# Altium project XT_NANO_DOCK.PrjPcb
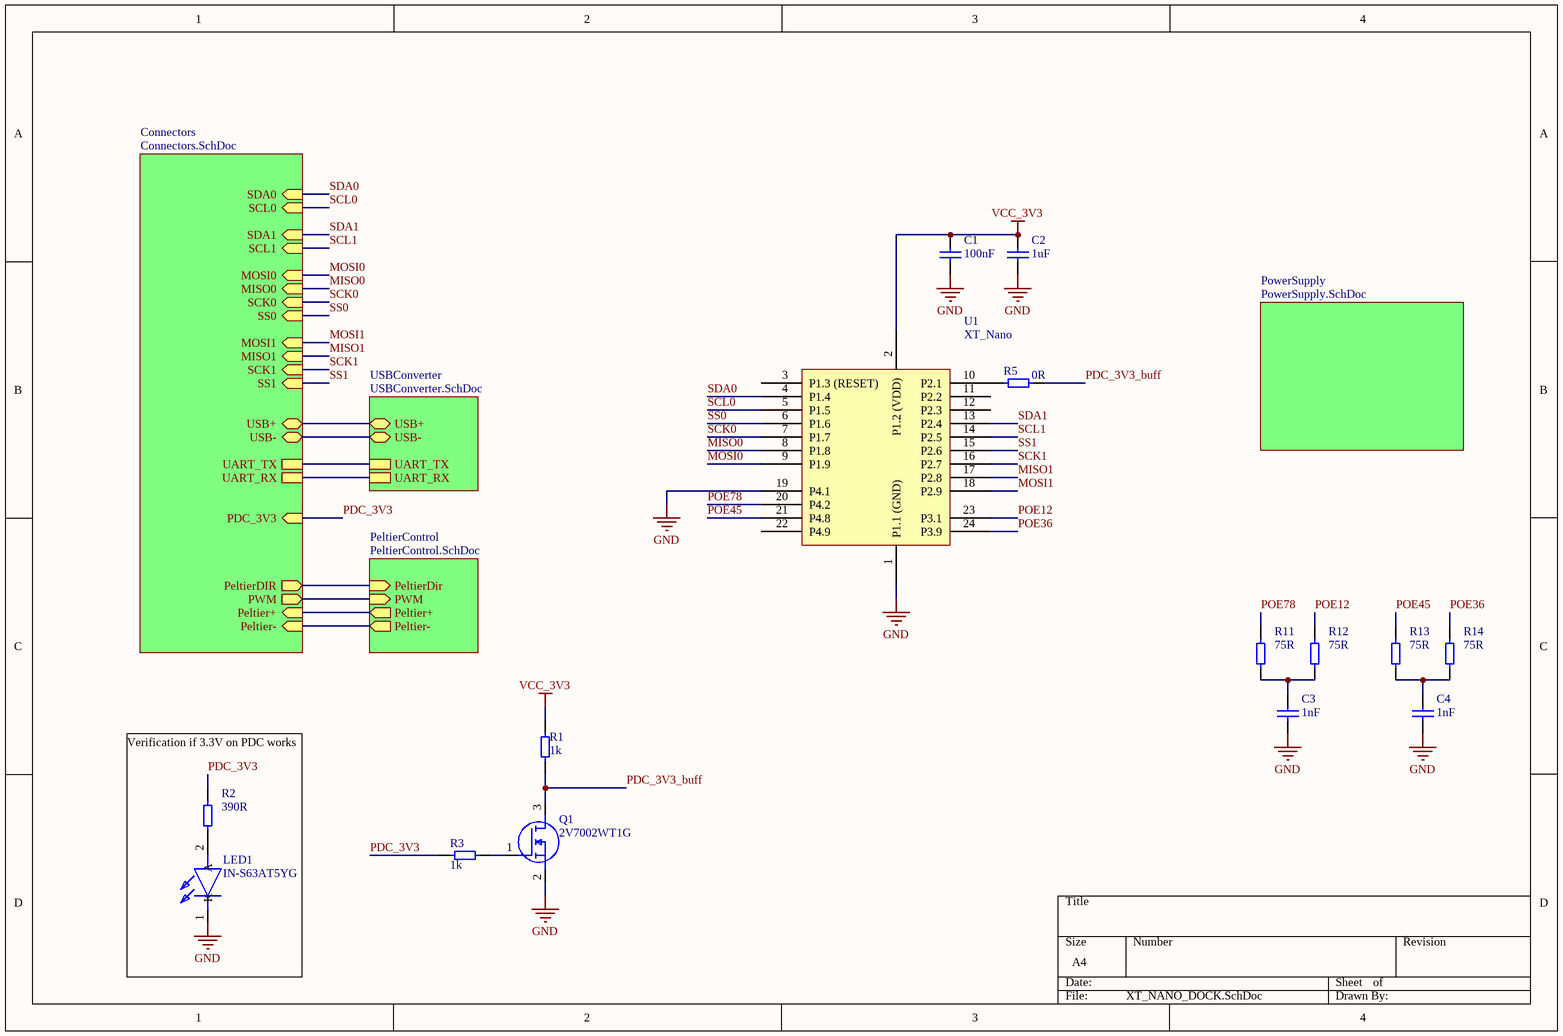
[diagram p0: XT_NANO_DOCK.SchDoc]
6 sheets, 111 parts. Net scope: hierarchical (ports join the sheet entries above them; power ports are global).
Board file: XT_NANO_DOCK.PcbDoc
Sheets:
  XT_NANO_DOCK.SchDoc
    PowerSupply = PowerSupply.SchDoc
    PeltierControl = PeltierControl.SchDoc
    Connectors = Connectors.SchDoc
      Protection = Protection.SchDoc
    USBConverter = USBConverter.SchDoc

## Sheet XT_NANO_DOCK.SchDoc
size A4

### Parts
C1  100nF  [0603-Capacitor]
C2  1uF  [0603-Capacitor]
C3  1nF  [0603-Capacitor]
C4  1nF  [0603-Capacitor]
LED1  IN-S63AT5YG  [LEDM168X39N]
Q1  2V7002WT1G  [SOT65P220X100-3N]
R1  1k  [0603-Resistor]
R2  390R  [0603-Resistor]
R3  1k  [0603-Resistor]
R5  0R  [0603-Resistor]
R11  75R  [0603-Resistor]
R12  75R  [0603-Resistor]
R13  75R  [0603-Resistor]
R14  75R  [0603-Resistor]
U1  XT_Nano  [XT-PICO]

### Sub-sheets
Connectors = Connectors.SchDoc: SDA0 (in), SCL0 (in), SDA1 (in), SCL1 (in), MISO0 (in), SCK0 (in), SS0 (in), MOSI0 (in), MISO1 (in), SCK1 (in), SS1 (in), MOSI1 (in), USB+ (bidir), USB- (bidir), PDC_3V3 (in), PeltierDIR (out), PWM (out), UART_TX, UART_RX, Peltier+ (in), Peltier- (in)
PeltierControl = PeltierControl.SchDoc: PWM (in), PeltierDir (in), Peltier+ (out), Peltier- (out)
PowerSupply = PowerSupply.SchDoc: no entries
USBConverter = USBConverter.SchDoc: USB- (bidir), USB+ (bidir), UART_TX, UART_RX

### Nets
GND: C1.2 C2.2 C3.2 C4.2 LED1.1(K) Q1.2(S) U1.1(P1.1_(GND)) U1.19(P4.1)
VCC_3V3: C1.1 C2.1 R1.1 U1.2(P1.2_(VDD))
MISO0: U1.8(P1.8) ; sheet Connectors/MISO0
MISO1: U1.17(P2.8) ; sheet Connectors/MISO1
MOSI0: U1.9(P1.9) ; sheet Connectors/MOSI0
MOSI1: U1.18(P2.9) ; sheet Connectors/MOSI1
PDC_3V3: R2.2 R3.2 ; sheet Connectors/PDC_3V3
PDC_3V3_buff: Q1.3(D) R1.2 R5.1
POE12: R12.2 U1.23(P3.1)
POE36: R14.2 U1.24(P3.9)
POE45: R13.2 U1.21(P4.8)
POE78: R11.2 U1.20(P4.2)
SCK0: U1.7(P1.7) ; sheet Connectors/SCK0
SCK1: U1.16(P2.7) ; sheet Connectors/SCK1
SCL0: U1.5(P1.5) ; sheet Connectors/SCL0
SCL1: U1.14(P2.5) ; sheet Connectors/SCL1
SDA0: U1.4(P1.4) ; sheet Connectors/SDA0
SDA1: U1.13(P2.4) ; sheet Connectors/SDA1
SS0: U1.6(P1.6) ; sheet Connectors/SS0
SS1: U1.15(P2.6) ; sheet Connectors/SS1
USB_prot_N: sheet Connectors/USB-, sheet USBConverter/USB-
USB_prot_P: sheet Connectors/USB+, sheet USBConverter/USB+
NetC3_1: C3.1 R11.1 R12.1
NetC4_1: C4.1 R13.1 R14.1
NetIC1_1: sheet PeltierControl/PWM, sheet Connectors/PWM
NetIC2_1: sheet PeltierControl/PeltierDir, sheet Connectors/PeltierDIR
NetJ1_2: sheet Connectors/UART_TX, sheet USBConverter/UART_TX
NetJ1_10: sheet Connectors/UART_RX, sheet USBConverter/UART_RX
NetJ6_1: sheet PeltierControl/Peltier-, sheet Connectors/Peltier-
NetJ6_2: sheet PeltierControl/Peltier+, sheet Connectors/Peltier+
NetLED1_2: LED1.2(A) R2.1
NetQ1_1: Q1.1(G) R3.1
NetR5_2: R5.2 U1.10(P2.1)

Not connected (* = marked no-connect by the designer): U1 3(P1.3_(RESET)) 11(P2.2) 12(P2.3) 22(P4.9)

### Notes on the sheet
- Verification if 3.3V on PDC works

### Library data of the parts
C1-C4 = C0603: Capacitor; Part Number: C0603; Pin Count: 2; Manufacturer: *; Package: 0603; ManufacturerNr: *; Voltage Rating: *; Dielectric: *
  C1: Value: 100nF
  C2: Value: 1uF
  C3 C4: Value: 1nF
LED1 = IN-S63AT5G: LED; Manufacturer_Name: Inolux; Datasheet Link: http://www.inolux-corp.com/datasheet/SMDLED/Mono%20Color%20Top%20View/IN-S63AT%20Series_V1.1.pdf; Height: 0.39mm; Manufacturer_Part_Number: IN-S63AT5YG; Mouser Part Number: 743-IN-S63AT5G; Mouser Price/Stock: https://www.mouser.com/Search/Refine.aspx?Keyword=743-IN-S63AT5G
Q1 = 2V7002WT1G: MOSFET (N-Channel); Manufacturer_Name: ON Semiconductor; Datasheet Link: http://www.onsemi.com/pub/Collateral/2N7002W-D.PDF; Height: 1mm; Manufacturer_Part_Number: 2V7002WT1G; Mouser Part Number: 863-2V7002WT1G; Mouser Price/Stock: https://www.mouser.com/Search/Refine.aspx?Keyword=863-2V7002WT1G; RS Part Number: 7905246P; RS Price/Stock: http://uk.rs-online.com/web/p/products/7905246P
R1 R3 R5 R11-R14 = R0603: Resistor; Part Number: R0603; Pin Count: 2; Manufacturer: *; Package: 0603; ManufacturerNr: *
  R1 R3: Value: 1k
  R5: Value: 0R
  R11-R14: Value: 75R
R2 = R0603: Resistor; Part Number: R0603; Value: 680R; Pin Count: 2; Manufacturer: *; Package: 0603; ManufacturerNr: *
U1 = XT_Nano: XT nano module by ak-nord; Manufacturer Nr: XT-NANO-SXL; Manufacturer: Ak-nord

## Sheet PowerSupply.SchDoc
size A4
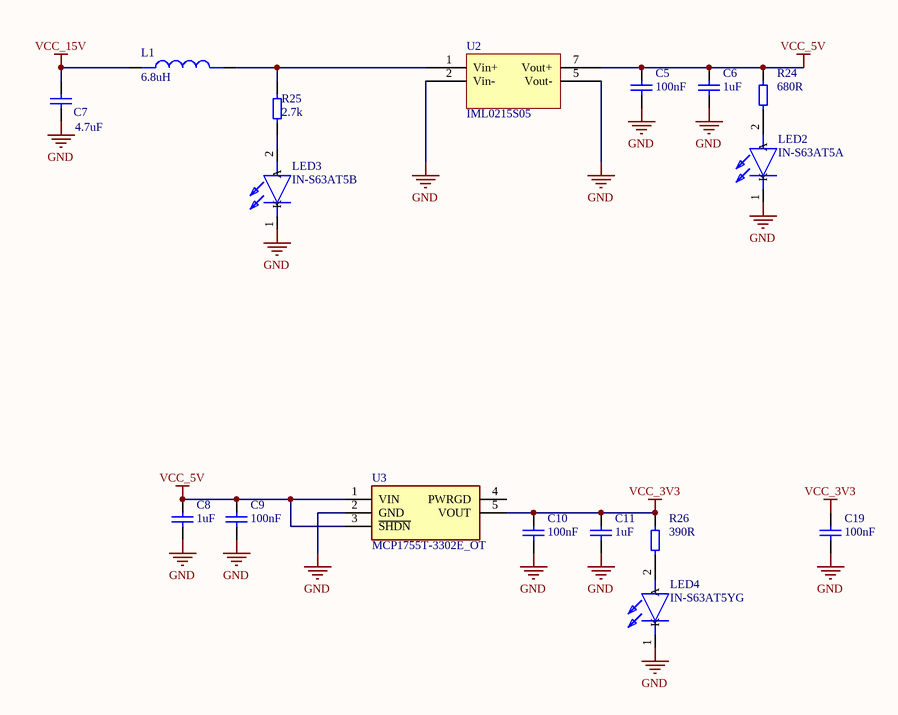
[diagram p1: PowerSupply.SchDoc]

### Parts
C5  100nF  [0603-Capacitor]
C6  1uF  [0603-Capacitor]
C7  4.7uF  [1206-Capacitor]
C8  1uF  [0603-Capacitor]
C9  100nF  [0603-Capacitor]
C10  100nF  [0603-Capacitor]
C11  1uF  [0603-Capacitor]
C19  100nF  [0603-Capacitor]
L1  6.8uH  [NRH2410T6R8MN]
LED2  IN-S63AT5A  [LEDM168X39N]
LED3  IN-S63AT5B  [LEDM168X39N]
LED4  IN-S63AT5YG  [LEDM168X39N]
R24  680R  [0603-Resistor]
R25  2.7k  [0805-Resistor]
R26  390R  [0603-Resistor]
U2  IML0215S05  [IML02S]
U3  MCP1755T-3302E_OT  [SOT95P270X145-5N]

### Nets
GND: C5.2 C6.2 C7.2 C8.2 C9.2 C10.2 C11.2 C19.2 LED2.1(K) LED3.1(K) LED4.1(K) U2.2(Vin-) U2.5(Vout-) U3.2(GND)
VCC_3V3: C10.1 C11.1 C19.1 R26.2 U3.5(VOUT)
VCC_5V: C5.1 C6.1 C8.1 C9.1 R24.2 U2.7(Vout+) U3.1(VIN) U3.3(~{SHDN})
VCC_15V: C7.1 L1.1(RF-IN)
NetL1_2: L1.2(RF-OUT) R25.2 U2.1(Vin+)
NetLED2_2: LED2.2(A) R24.1
NetLED3_2: LED3.2(A) R25.1
NetLED4_2: LED4.2(A) R26.1

Not connected (* = marked no-connect by the designer): U3 4(PWRGD)

### Library data of the parts
C5 C6 C8-C11 C19 = C0603: Capacitor; Part Number: C0603; Pin Count: 2; Manufacturer: *; Package: 0603; ManufacturerNr: *; Voltage Rating: *; Dielectric: *
  C5 C9 C10 C19: Value: 100nF
  C6 C8 C11: Value: 1uF
C7 = C1206: Capacitor; Part Number: C1206; Pin Count: 2; Manufacturer: *; Package: 1206; ManufacturerNr: *; Value: 4.7uF; Voltage Rating: *; Dielectric: *
L1 = LQG18HN22NJ00D: Chip Inductor; Manufacturer: Taiyo Yuden; Value: 6.8uH; Part Number: NRH2410T6R8MN; Pin Count: 2; ManufacturerNr: NRH2410T6R8MN
LED2-LED4 = IN-S63AT5G: LED; Manufacturer_Name: Inolux; Datasheet Link: http://www.inolux-corp.com/datasheet/SMDLED/Mono%20Color%20Top%20View/IN-S63AT%20Series_V1.1.pdf; Height: 0.39mm; Mouser Part Number: 743-IN-S63AT5G; Mouser Price/Stock: https://www.mouser.com/Search/Refine.aspx?Keyword=743-IN-S63AT5G
  LED2: Manufacturer_Part_Number: IN-S63AT5A
  LED3: Manufacturer_Part_Number: IN-S63AT5B
  LED4: Manufacturer_Part_Number: IN-S63AT5YG
R24 = R0603: Resistor; Part Number: R0603; Pin Count: 2; Manufacturer: *; Package: 0603; ManufacturerNr: *; Value: 680R
R25 = R0805: Resistor; Part Number: R0805; Pin Count: 2; Manufacturer: *; Package: 0805; ManufacturerNr: *; Value: 2.7k
R26 = R0603: as R2 on sheet XT_NANO_DOCK; Pin Count: 2; Manufacturer: *; Package: 0603; ManufacturerNr: *
U2 = IML0215S05: XP power converter 15V->5V, 400mA; Manufacturer: XP Power; Manufacturer Nr: IML0215S05
U3 = MCP1755T-3302E_OT: Undefined or Miscellaneous; Manufacturer_Name: Microchip; Manufacturer_Part_Number: MCP1755T-3302E/OT; Datasheet Link: https://componentsearchengine.com/Datasheets/1/MCP1755T-3302E_OT.pdf; Height: 1.45mm

## Sheet PeltierControl.SchDoc
size A4
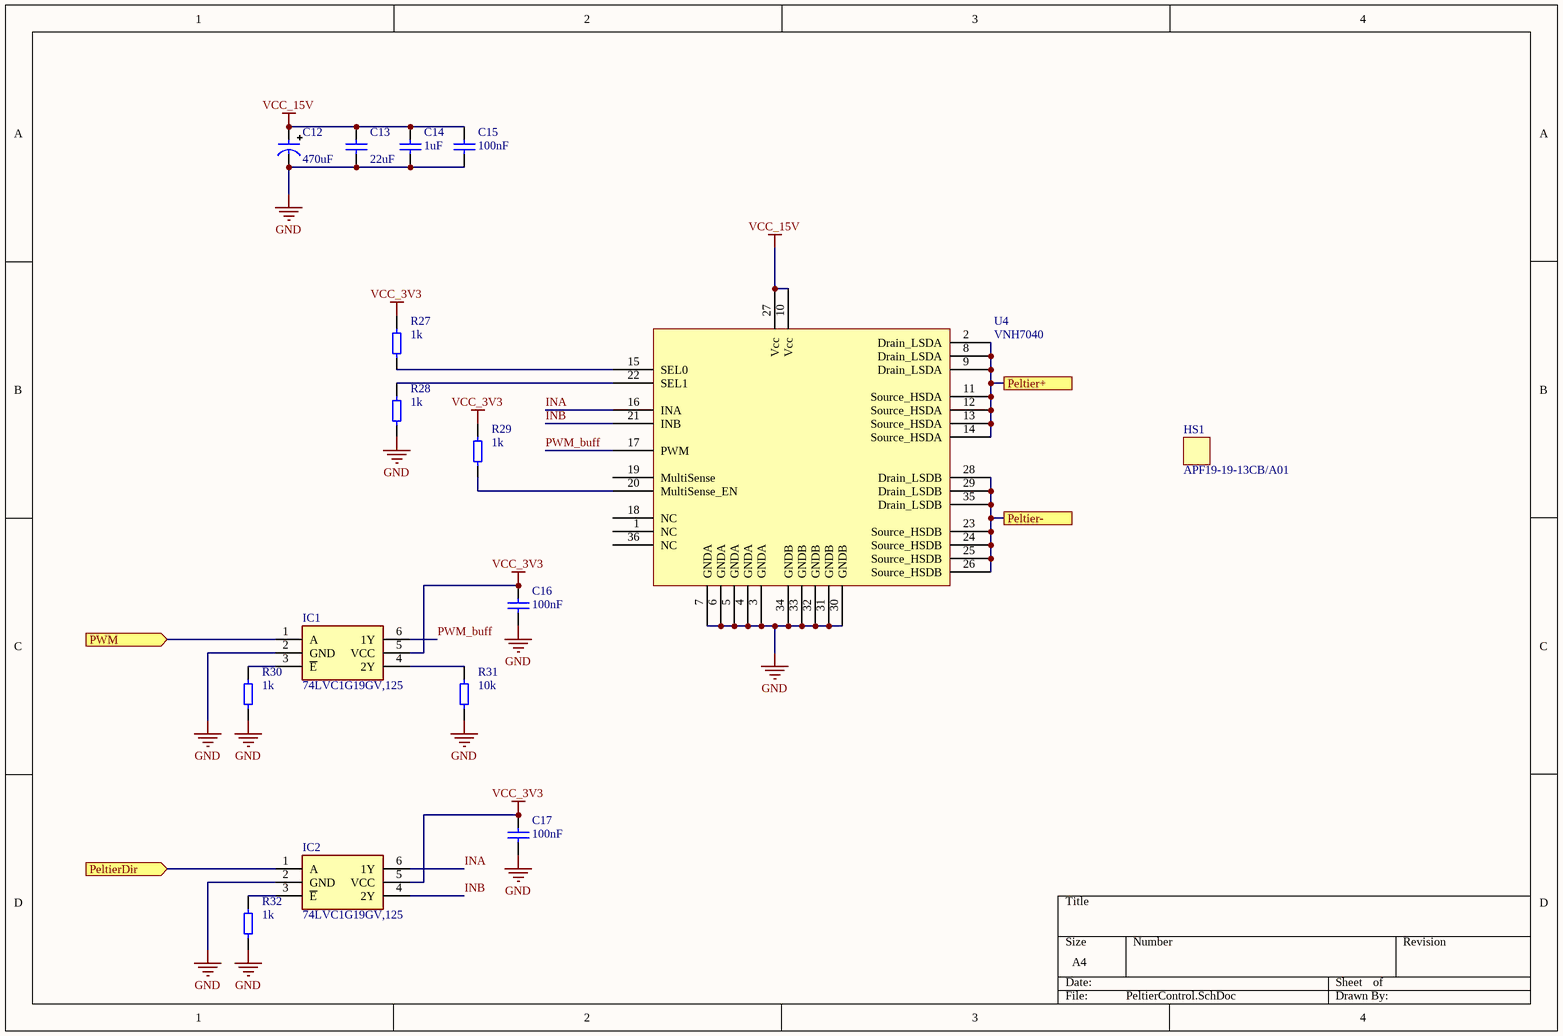
[diagram p2: PeltierControl.SchDoc]

### Parts
C12  470uF  [EEV-FK1H471M]
C13  22uF  [0805-Capacitor]
C14  1uF  [0603-Capacitor]
C15  100nF  [0603-Capacitor]
C16  100nF  [0603-Capacitor]
C17  100nF  [0603-Capacitor]
HS1  APF19-19-13CB/A01  [APF19-19-13CB/A01]
IC1  74LVC1G19GV,125  [SOT95P275X110-6N]
IC2  74LVC1G19GV,125  [SOT95P275X110-6N]
R27  1k  [0603-Resistor]
R28  1k  [0603-Resistor]
R29  1k  [0603-Resistor]
R30  1k  [0603-Resistor]
R31  10k  [0603-Resistor]
R32  1k  [0603-Resistor]
U4  VNH7040  [PowerSSO-36]

### Ports
Peltier+, Peltier-, PeltierDir (in), PWM (in)

### Nets
GND: C12.2 C13.2 C14.2 C15.2 C16.2 C17.2 IC1.2(GND) IC2.2(GND) R28.1 R30.1 R31.1 R32.1 U4.3(GNDA) U4.4(GNDA) U4.5(GNDA) U4.6(GNDA) U4.7(GNDA) U4.30(GNDB) U4.31(GNDB) U4.32(GNDB) U4.33(GNDB) U4.34(GNDB)
VCC_3V3: C16.1 C17.1 IC1.5(VCC) IC2.5(VCC) R27.2 R29.2
VCC_15V: C12.1 C13.1 C14.1 C15.1 U4.10(Vcc) U4.27(Vcc)
INA: IC2.6(1Y) U4.16(INA)
INB: IC2.4(2Y) U4.21(INB)
PWM_buff: IC1.6(1Y) U4.17(PWM)
NetIC1_1: IC1.1(A) ; port PWM
NetIC1_3: IC1.3(~{E}) R30.2
NetIC1_4: IC1.4(2Y) R31.2
NetIC2_1: IC2.1(A) ; port PeltierDir
NetIC2_3: IC2.3(~{E}) R32.2
NetJ6_1: U4.23(Source_HSDB) U4.24(Source_HSDB) U4.25(Source_HSDB) U4.26(Source_HSDB) U4.28(Drain_LSDB) U4.29(Drain_LSDB) U4.35(Drain_LSDB) ; port Peltier-
NetJ6_2: U4.2(Drain_LSDA) U4.8(Drain_LSDA) U4.9(Drain_LSDA) U4.11(Source_HSDA) U4.12(Source_HSDA) U4.13(Source_HSDA) U4.14(Source_HSDA) ; port Peltier+
NetR27_1: R27.1 U4.15(SEL0)
NetR28_2: R28.2 U4.22(SEL1)
NetR29_1: R29.1 U4.20(MultiSense_EN)

Not connected (* = marked no-connect by the designer): U4 1(NC) 18(NC) 19(MultiSense) 36(NC)

### Library data of the parts
C12 = Panasonic_FK_PCR_6.3_Capacitor: Aluminum Electrolytic Capacitors; Voltage Rating: 50V; Tolerance: 20%; HelpURL: http://www.farnell.com/datasheets/2002520.pdf?_ga=2.2422448.16562209.1508850292-516227586.1495631175; Supplier 1: Farnell; Package: PCR-6.3-7.7; Manufacturer: Panasonic; Supplier Part Number 1: *; ManufacturerNr: EEV-FK1H471M; Pin Count: 2; Value: 470uF; Dielectric: Aluminum Electrolytic; Series: FK; Part Number: Panasonic_FK_PCR_6.3_Capacitor
C13 = C0805: Capacitor; Part Number: C0805; Pin Count: 2; Manufacturer: *; Package: 0805; ManufacturerNr: *; Value: 22uF; Voltage Rating: *; Dielectric: *
C14-C17 = C0603: Capacitor; Part Number: C0603; Pin Count: 2; Manufacturer: *; Package: 0603; ManufacturerNr: *; Voltage Rating: *; Dielectric: *
  C14: Value: 1uF
  C15-C17: Value: 100nF
HS1 = heatsink: Manufacturer: CTS Electronic Components; Manufacturer Nr: APF19-19-13CB/A01
IC1 IC2 = 74LVC1G19GV,125: Integrated Circuit; Manufacturer_Name: Nexperia; Datasheet Link: https://assets.nexperia.com/documents/data-sheet/74LVC1G19.pdf; Height: 1.1mm; Manufacturer_Part_Number: 74LVC1G19GV,125
R27-R32 = R0603: Resistor; Part Number: R0603; Pin Count: 2; Manufacturer: *; Package: 0603; ManufacturerNr: *
  R27-R30 R32: Value: 1k
  R31: Value: 10k
U4 = VNH7040: Engine driver/ H bridge; Manufacturer: STMicroelectronics; Manufacturer Nr: VNH7040AYTR

## Sheet Connectors.SchDoc
size A4
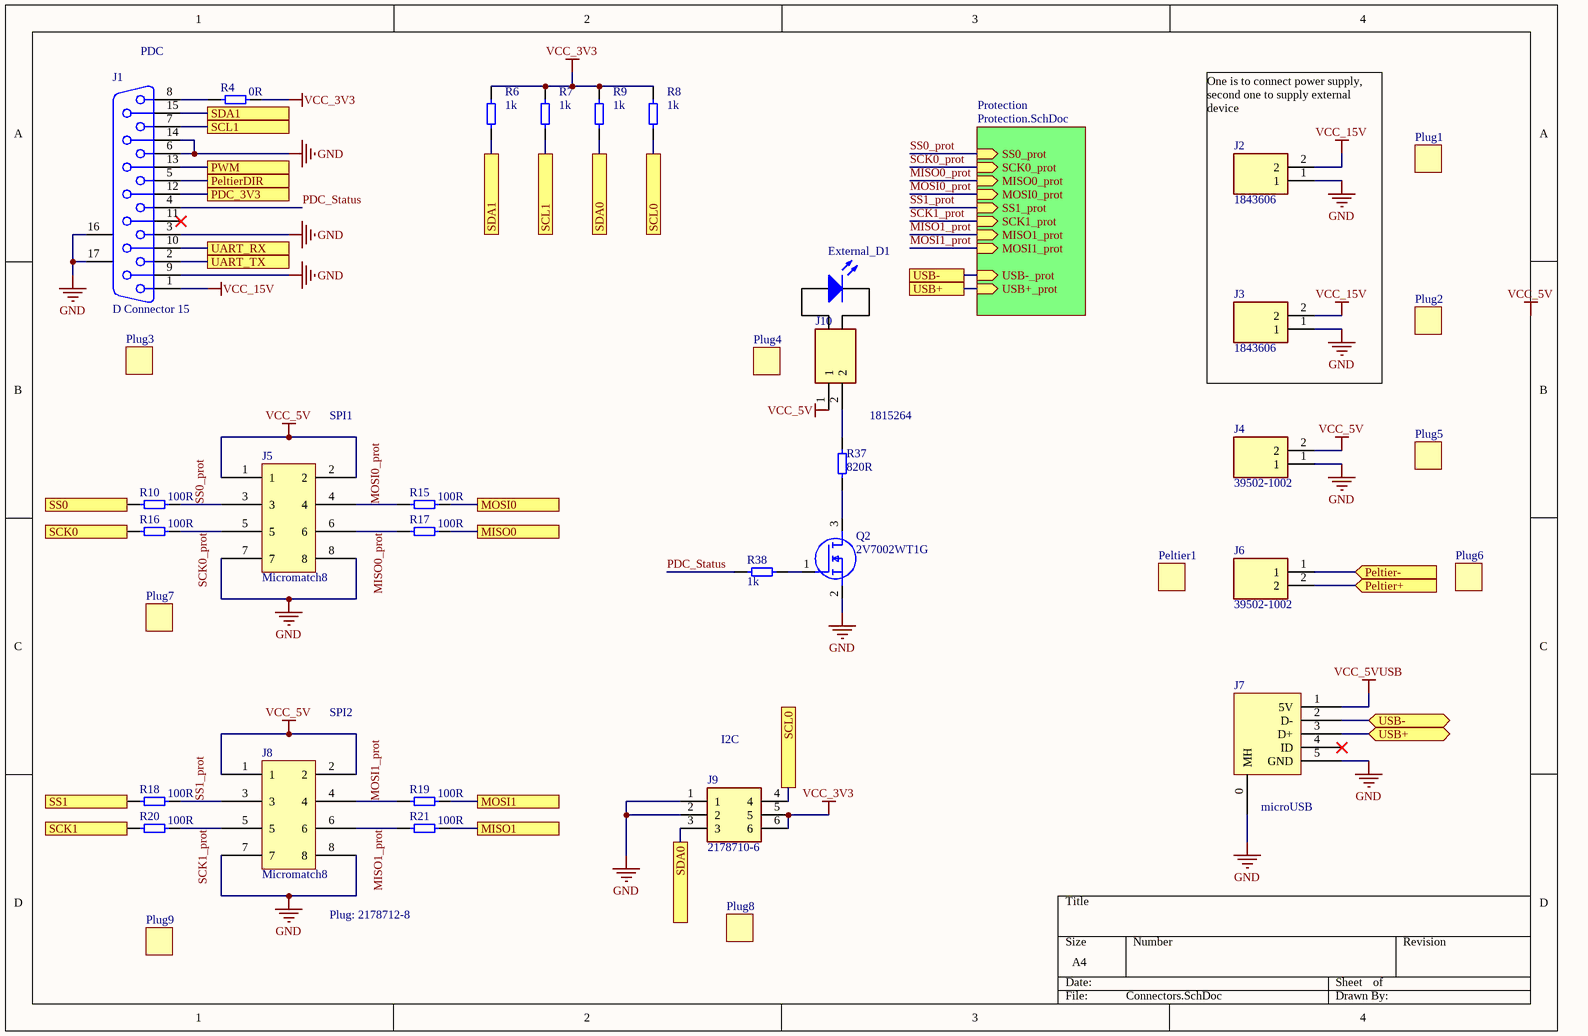
[diagram p3: Connectors.SchDoc]

### Parts
External_D1  LED0  (value not drawn)
J1  D Connector 15  [DSUB_15_D15S33E4GV00LF]
J2  1843606  [SHDR2W80P0X350_1X2_840X725X920P]
J3  1843606  [SHDR2W80P0X350_1X2_840X725X920P]
J4  39502-1002  [SHDR2W110P0X350_1X2_840X920X690P]
J5  Micromatch8  [micromatch8]
J6  39502-1002  [SHDR2W110P0X350_1X2_840X920X690P]
J7  microUSB  [microUSB_molex_476540001]
J8  Micromatch8  [micromatch8]
J9  2178710-6  [21787106]
J10  1815264  [1815264]
Peltier1  plug  (value not drawn)
Plug1  plug  (value not drawn)
Plug2  plug  (value not drawn)
Plug3  plug  (value not drawn)
Plug4  plug  (value not drawn)
Plug5  plug  (value not drawn)
Plug6  plug  (value not drawn)
Plug7  plug  (value not drawn)
Plug8  plug  (value not drawn)
Plug9  plug  (value not drawn)
Q2  2V7002WT1G  [SOT65P220X100-3N]
R4  0R  [0603-Resistor]
R6  1k  [0603-Resistor]
R7  1k  [0603-Resistor]
R8  1k  [0603-Resistor]
R9  1k  [0603-Resistor]
R10  100R  [0603-Resistor]
R15  100R  [0603-Resistor]
R16  100R  [0603-Resistor]
R17  100R  [0603-Resistor]
R18  100R  [0603-Resistor]
R19  100R  [0603-Resistor]
R20  100R  [0603-Resistor]
R21  100R  [0603-Resistor]
R37  820R  [0603-Resistor]
R38  1k  [0603-Resistor]

### Sub-sheets
Protection = Protection.SchDoc: SS0_prot (in), SCK0_prot (in), MISO0_prot (in), MOSI0_prot (in), SS1_prot (in), SCK1_prot (in), MISO1_prot (in), MOSI1_prot (in), USB-_prot (in), USB+_prot (in)

### Ports
MISO0, MISO1, MOSI0, MOSI1, PDC_3V3, Peltier+ (in), Peltier- (in), PeltierDIR, PWM, SCK0, SCK1, SCL0, SCL1, SDA0, SDA1, SS0, SS1, UART_RX, UART_TX, USB+, USB+ (bidir), USB-, USB- (bidir)

### Nets
GND: J1.3 J1.6 J1.9 J1.14 J1.16(MH1) J1.17(MH2) J2.1 J3.1 J4.1 J5.7 J5.8 J7.0(MH) J7.5(GND) J8.7 J8.8 J9.1 J9.2 Q2.2(S)
VCC_3V3: J9.5 J9.6 R4.1 R6.2 R7.2 R8.2 R9.2
VCC_5V: J4.2 J5.1 J5.2 J8.1 J8.2 J10.1
VCC_5VUSB: J7.1(5V)
VCC_15V: J1.1 J2.2 J3.2
MISO0: R17.1 ; port MISO0
MISO0_prot: J5.6 R17.2 ; sheet Protection/MISO0_prot
MISO1: R21.1 ; port MISO1
MISO1_prot: J8.6 R21.2 ; sheet Protection/MISO1_prot
MOSI0: R15.1 ; port MOSI0
MOSI0_prot: J5.4 R15.2 ; sheet Protection/MOSI0_prot
MOSI1: R19.1 ; port MOSI1
MOSI1_prot: J8.4 R19.2 ; sheet Protection/MOSI1_prot
PDC_3V3: J1.12 ; port PDC_3V3
PDC_Status: J1.4 R38.2
SCK0: R16.2 ; port SCK0
SCK0_prot: J5.5 R16.1 ; sheet Protection/SCK0_prot
SCK1: R20.2 ; port SCK1
SCK1_prot: J8.5 R20.1 ; sheet Protection/SCK1_prot
SCL0: J9.4 R8.1 ; port SCL0
SCL1: J1.7 R7.1 ; port SCL1
SDA0: J9.3 R9.1 ; port SDA0
SDA1: J1.15 R6.1 ; port SDA1
SS0: R10.2 ; port SS0
SS0_prot: J5.3 R10.1 ; sheet Protection/SS0_prot
SS1: R18.2 ; port SS1
SS1_prot: J8.3 R18.1 ; sheet Protection/SS1_prot
USB_prot_N: J7.2(D-) ; port USB-, sheet Protection/USB-_prot
USB_prot_P: J7.3(D+) ; port USB+, sheet Protection/USB+_prot
NetIC1_1: J1.13 ; port PWM
NetIC2_1: J1.5 ; port PeltierDIR
NetJ1_2: J1.2 ; port UART_TX
NetJ1_8: J1.8 R4.2
NetJ1_10: J1.10 ; port UART_RX
NetJ6_1: J6.1 ; port Peltier-
NetJ6_2: J6.2 ; port Peltier+
NetJ10_2: J10.2 R37.1
NetQ2_1: Q2.1(G) R38.1
NetQ2_3: Q2.3(D) R37.2

Not connected (* = marked no-connect by the designer): External_D1 1(A) 2(K); J1 11*; J7 4(ID)*

### Notes on the sheet
- (near J1) PDC
- One is to connect power supply, second one to supply external device
- SPI1
- SPI2
- I2C
- Plug: 2178712-8
- Labels drawn without touching a wire or pin: VCC_5V

### Library data of the parts
External_D1 = LED0: External panel mounted LED; Manufacturer: Dialight; Manufacturer Nr: 559-5201-007F
J1 = D Connector 15: Receptacle Assembly, 15 Position, Right Angle; Manufacturer: Amphenol ICC; Manufacturer Nr: D15S33E4GV00LF; PackageDocument: O; Positions: 15; Published: 15-Jun-2001; LatestRevisionDate: 17-Jul-2002; LatestRevisionNote: Re-released for DXP Platform.; DatasheetDocument: 1-Sep-99; PackageReference: 788757; Publisher: Altium Limited; Orientation: Right Angle; Gender: Receptacle
J2 J3 = 1843606: Connector; Manufacturer_Name: Phoenix Contact; Allied_Number: 70054529; Datasheet Link: https://componentsearchengine.com/Datasheets/2/1843606.pdf; Height: 9.2mm; Manufacturer_Part_Number: 1843606; Mouser Part Number: 651-1843606; Mouser Price/Stock: https://www.mouser.com/Search/Refine.aspx?Keyword=651-1843606; RS Part Number: 8042194; RS Price/Stock: http://uk.rs-online.com/web/p/products/8042194; Allied Price/Stock: https://www.alliedelec.com/phoenixcontact-1843606/70054529/
J4 J6 = 39502-1002: Connector; Manufacturer_Name: Molex; Allied_Number: E5293141; Datasheet Link: https://www.molex.com/webdocs/datasheets/pdf/en-us/0395021002_TERMINAL_BLOCKS.pdf; Height: 6.9mm; Manufacturer_Part_Number: 39502-1002; Mouser Part Number: 538-39502-1002; Mouser Price/Stock: https://www.mouser.com/Search/Refine.aspx?Keyword=538-39502-1002; Allied Price/Stock: https://www.alliedelec.com/molex-incorporated-39502-1002/E5293141/
J5 J8 = Micromatch8: Manufacturer: TE Connectivity; Manufacturer Nr: 2178710-8
J7 = microUSB_molex_476540001: Molex 476540001; Manufacturer: Molex; Manufacturer Nr: 476540001
J9 = 2178710-6: Connector; Manufacturer_Name: TE Connectivity; Datasheet Link: https://www.te.com/commerce/DocumentDelivery/DDEController?Action=showdoc&DocId=Customer+Drawing%7F2178710%7FA%7Fpdf%7FEnglish%7FENG_CD_2178710_A_pdf_c-2178710_drw.pdf%7F2178710-6; Height: 4.2mm; Manufacturer_Part_Number: 2178710-6; Mouser Part Number: 571-2178710-6; Mouser Price/Stock: https://www.mouser.com/Search/Refine.aspx?Keyword=571-2178710-6; RS Part Number: 8475468P; RS Price/Stock: http://uk.rs-online.com/web/p/products/8475468P
J10 = 1815264: Connector; Manufacturer_Name: Phoenix Contact; Allied_Number: 70282220; Datasheet Link: https://www.phoenixcontact.com/online/portal/in?uri=pxc-oc-itemdetail:pid=1815264&library=inen&tab=1; Height: 7.65mm; Manufacturer_Part_Number: 1815264; Mouser Part Number: 651-1815264; Mouser Price/Stock: https://www.mouser.com/Search/Refine.aspx?Keyword=651-1815264; RS Part Number: 8020138; RS Price/Stock: http://uk.rs-online.com/web/p/products/8020138; Allied Price/Stock: https://www.alliedelec.com/phoenixcontact-1815264/70282220/
Peltier1 = plug: Manufacturer: Laird Thermal Systems; Manufacturer Nr: 430848-504
Plug1 Plug2 = plug: Manufacturer: Phoenix Contact; Manufacturer Nr: 1952267
Plug3 = plug: Manufacturer: Amphenol; Manufacturer Nr: L17DAFRA15P
Plug4 = plug: Manufacturer: Phoenix Contact; Manufacturer Nr: 1709457
Plug5 Plug6 = plug: Manufacturer: Molex; Manufacturer Nr: 39500-0002
Plug7 Plug9 = plug: Manufacturer: TE Connectivity; Manufacturer Nr: 2178712-8
Plug8 = plug: Manufacturer: TE Connectivity; Manufacturer Nr: 2178712-6
Q2 = 2V7002WT1G: as Q1 on sheet XT_NANO_DOCK; Datasheet Link: http://www.onsemi.com/pub/Collateral/2N7002W-D.PDF; Height: 1mm; Manufacturer_Part_Number: 2V7002WT1G; Mouser Part Number: 863-2V7002WT1G; Mouser Price/Stock: https://www.mouser.com/Search/Refine.aspx?Keyword=863-2V7002WT1G; RS Part Number: 7905246P; RS Price/Stock: http://uk.rs-online.com/web/p/products/7905246P
R4 R6-R10 R15-R21 R38 = R0603: Resistor; Part Number: R0603; Pin Count: 2; Manufacturer: *; Package: 0603; ManufacturerNr: *
  R4: Value: 0R
  R6-R9 R38: Value: 1k
  R10 R15-R21: Value: 100R
R37 = R0603: Resistor; Part Number: R0603; Value: 420R; Pin Count: 2; Manufacturer: *; Package: 0603; ManufacturerNr: *

## Sheet Protection.SchDoc
size A4
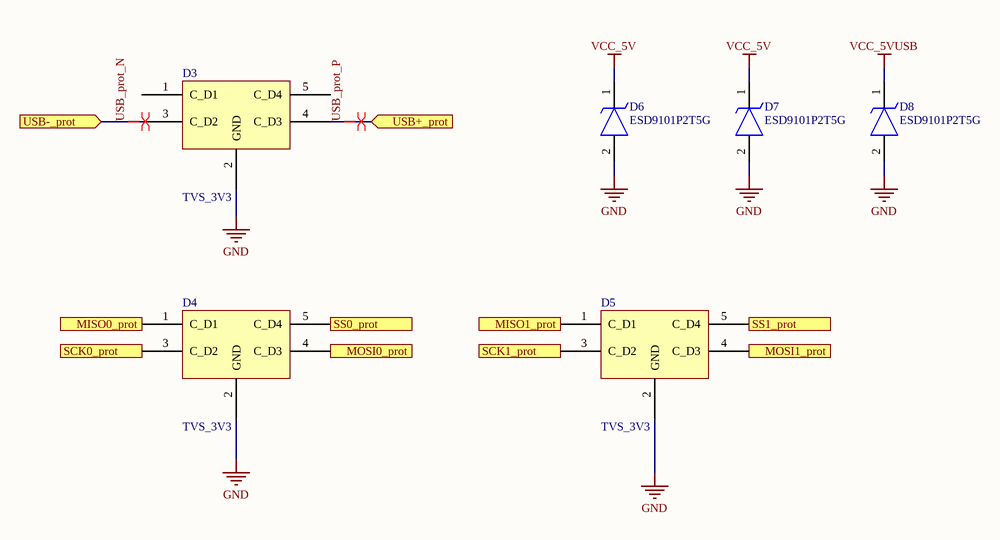
[diagram p4: Protection.SchDoc]

### Parts
D3  TVS_3V3  [SOT353]
D4  TVS_3V3  [SOT353]
D5  TVS_3V3  [SOT353]
D6  ESD9101P2T5G  [SODFL1006X40N]
D7  ESD9101P2T5G  [SODFL1006X40N]
D8  ESD9101P2T5G  [SODFL1006X40N]

### Ports
MISO0_prot (in), MISO1_prot (in), MOSI0_prot (in), MOSI1_prot (in), SCK0_prot (in), SCK1_prot (in), SS0_prot (in), SS1_prot (in), USB+_prot (in), USB-_prot (in)

### Nets
GND: D3.2(GND) D4.2(GND) D5.2(GND) D6.2(A) D7.2(A) D8.2(A)
VCC_5V: D6.1(K) D7.1(K)
VCC_5VUSB: D8.1(K)
MISO0_prot: D4.1(C_D1) ; port MISO0_prot
MISO1_prot: D5.1(C_D1) ; port MISO1_prot
MOSI0_prot: D4.4(C_D3) ; port MOSI0_prot
MOSI1_prot: D5.4(C_D3) ; port MOSI1_prot
SCK0_prot: D4.3(C_D2) ; port SCK0_prot
SCK1_prot: D5.3(C_D2) ; port SCK1_prot
SS0_prot: D4.5(C_D4) ; port SS0_prot
SS1_prot: D5.5(C_D4) ; port SS1_prot
USB_prot_N: D3.3(C_D2) ; port USB-_prot
USB_prot_P: D3.4(C_D3) ; port USB+_prot

Not connected (* = marked no-connect by the designer): D3 1(C_D1) 5(C_D4)

### Layout directives
differential pair: USB_prot_N, USB_prot_P

### Library data of the parts
D3-D5 = TVS_3V3: 4 TVS dedicated for 3.3V circuits; Manufacturer: Nexperia; Manufacturer Nr: PESD3V3L4UG,115
D6-D8 = ESD9101P2T5G: TVS Diode (Uni-directional); Manufacturer_Name: ON Semiconductor; Datasheet Link: http://www.onsemi.com/pub/Collateral/ESD9101-D.PDF; Height: 0.4mm; Manufacturer_Part_Number: ESD9101P2T5G; Mouser Part Number: 863-ESD9101P2T5G; Mouser Price/Stock: https://www.mouser.com/Search/Refine.aspx?Keyword=863-ESD9101P2T5G

## Sheet USBConverter.SchDoc
size A4
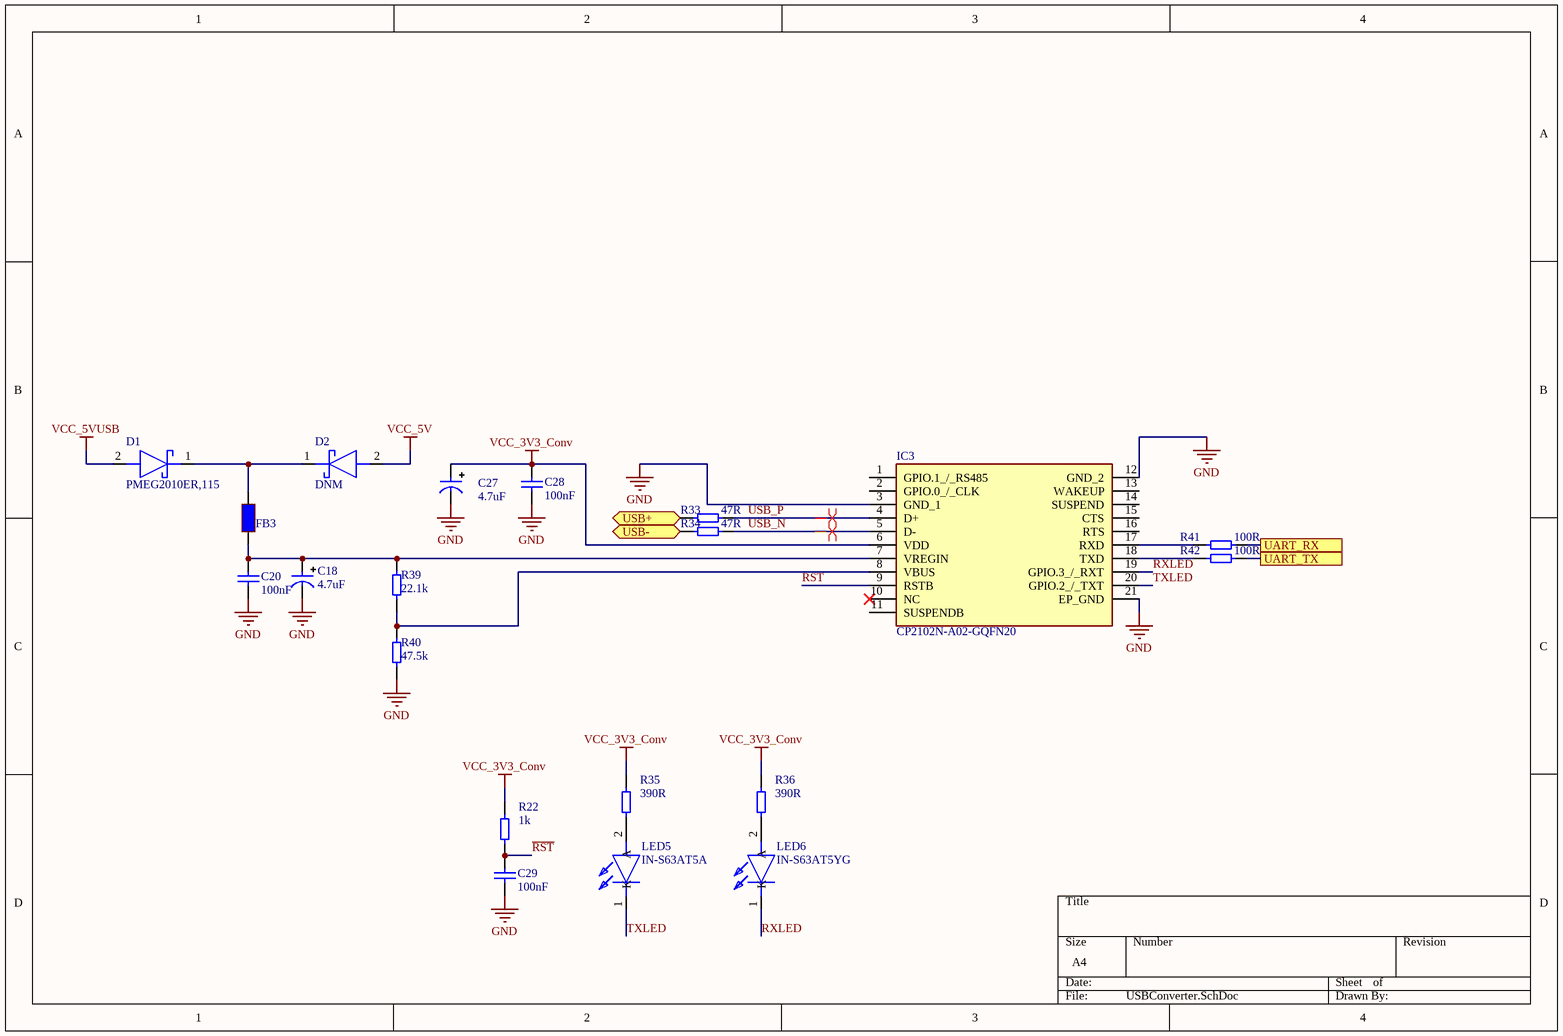
[diagram p5: USBConverter.SchDoc]

### Parts
C18  4.7uF  [A_3216]
C20  100nF  [0603-Capacitor]
C27  4.7uF  [A_3216]
C28  100nF  [0603-Capacitor]
C29  100nF  [0603-Capacitor]
D1  PMEG2010ER,115  [SODFL3517X110N]
D2  DNM  [SODFL3517X110N]
FB3  BLM18HE152SN1D  [0603-Ferrite bead]  (value not drawn)
IC3  CP2102N-A02-GQFN20  [CP2102NA02GQFN20]
LED5  IN-S63AT5A  [LEDM168X39N]
LED6  IN-S63AT5YG  [LEDM168X39N]
R22  1k  [0603-Resistor]
R33  47R  [0603-Resistor]
R34  47R  [0603-Resistor]
R35  390R  [0603-Resistor]
R36  390R  [0603-Resistor]
R39  22.1k  [0603-Resistor]
R40  47.5k  [0603-Resistor]
R41  100R  [0603-Resistor]
R42  100R  [0603-Resistor]

### Ports
UART_RX, UART_TX, USB+ (bidir), USB- (bidir)

### Nets
GND: C18.2 C20.2 C27.2 C28.2 C29.2 IC3.3(GND_1) IC3.12(GND_2) IC3.21(EP_GND) R40.2
VCC_3V3_Conv: C27.1 C28.1 IC3.6(VDD) R22.2 R35.2 R36.2
VCC_5V: D2.2(A)
VCC_5VUSB: D1.2(A)
~{RST}: C29.1 IC3.9(RSTB) R22.1
RXLED: IC3.19(GPIO.3_/_RXT) LED6.1(K)
TXLED: IC3.20(GPIO.2_/_TXT) LED5.1(K)
USB_N: IC3.5(D-) R34.1
USB_P: IC3.4(D+) R33.1
USB_prot_N: R34.2 ; port USB-
USB_prot_P: R33.2 ; port USB+
NetC18_1: C18.1 C20.1 FB3.1 IC3.7(VREGIN) R39.1
NetD1_1: D1.1(K) D2.1(K) FB3.2
NetIC3_8: IC3.8(VBUS) R39.2 R40.1
NetIC3_17: IC3.17(RXD) R41.2
NetIC3_18: IC3.18(TXD) R42.2
NetJ1_2: R42.1 ; port UART_TX
NetJ1_10: R41.1 ; port UART_RX
NetLED5_2: LED5.2(A) R35.1
NetLED6_2: LED6.2(A) R36.1

Not connected (* = marked no-connect by the designer): IC3 1(GPIO.1_/_RS485) 2(GPIO.0_/_CLK) 10(NC)* 11(SUSPENDB) 13(WAKEUP) 14(SUSPEND) 15(CTS) 16(RTS)

### Layout directives
differential pair: USB_N, USB_P

### Library data of the parts
C18 C27 = C_Case_A_3216: Polarized Tantalum Capacitor; Manufacturer: AVX; ManufacturerNr: TAJA475K010RNJV; Voltage Rating: 10V; Part Number: C_Case_A_3216; Pin Count: 2; Package: A; Value: 4.7uF
C20 C28 C29 = C0603: Capacitor; Part Number: C0603; Pin Count: 2; Manufacturer: *; Package: 0603; ManufacturerNr: *; Value: 100nF; Voltage Rating: *; Dielectric: *
D1 D2 = PMEG2010ER,115: Schottky Diode; Manufacturer_Name: Nexperia; Datasheet Link: https://assets.nexperia.com/documents/data-sheet/PMEG2010ER.pdf; Height: 1.1mm; Manufacturer_Part_Number: PMEG2010ER,115; Mouser Part Number: 771-PMEG2010ER115; Mouser Price/Stock: https://www.mouser.com/Search/Refine.aspx?Keyword=771-PMEG2010ER115; RS Part Number: 8166824P; RS Price/Stock: http://uk.rs-online.com/web/p/products/8166824P
FB3 = BLM18HE152SN1D: Ferrite Bead; Manufacturer: Murata; Value: 1.5k; Part Number: BLM18HE152SN1D; Pin Count: 2; Package: 0603; ManufacturerNr: BLM18HE152SN1D
IC3 = CP2102N-A02-GQFN20: Integrated Circuit; Manufacturer_Name: Silicon Labs; Datasheet Link: https://www.silabs.com/documents/public/data-sheets/cp2102n-datasheet.pdf; Height: 0.8mm; Manufacturer_Part_Number: CP2102N-A02-GQFN20; Mouser Part Number: 634-CP2102NA02GQFN20; Mouser Price/Stock: https://www.mouser.com/Search/Refine.aspx?Keyword=634-CP2102NA02GQFN20; RS Part Number: 1871330; RS Price/Stock: http://uk.rs-online.com/web/p/products/1871330
LED5 LED6 = IN-S63AT5G: LED; Manufacturer_Name: Inolux; Datasheet Link: http://www.inolux-corp.com/datasheet/SMDLED/Mono%20Color%20Top%20View/IN-S63AT%20Series_V1.1.pdf; Height: 0.39mm; Mouser Part Number: 743-IN-S63AT5G; Mouser Price/Stock: https://www.mouser.com/Search/Refine.aspx?Keyword=743-IN-S63AT5G
  LED5: Manufacturer_Part_Number: IN-S63AT5A
  LED6: Manufacturer_Part_Number: IN-S63AT5YG
R22 R33 R34 R39-R42 = R0603: Resistor; Part Number: R0603; Pin Count: 2; Manufacturer: *; Package: 0603; ManufacturerNr: *
  R22: Value: 1k
  R33 R34: Value: 47R
  R39: Value: 22.1k
  R40: Value: 47.5k
  R41 R42: Value: 100R
R35 R36 = R0603: as R2 on sheet XT_NANO_DOCK; Pin Count: 2; Manufacturer: *; Package: 0603; ManufacturerNr: *

## Nets that join several sheets
GND: XT_NANO_DOCK (8 pins), PowerSupply (14 pins), PeltierControl (22 pins), Connectors (18 pins), Protection (6 pins), USBConverter (9 pins)
VCC_3V3: XT_NANO_DOCK (C1.1 C2.1 R1.1 U1.2), PowerSupply (5 pins), PeltierControl (6 pins), Connectors (7 pins)
VCC_5V: PowerSupply (8 pins), Connectors (6 pins), Protection (D6.1 D7.1), USBConverter (D2.2)
VCC_5VUSB: Connectors (J7.1), Protection (D8.1), USBConverter (D1.2)
VCC_15V: PowerSupply (C7.1 L1.1), PeltierControl (6 pins), Connectors (J1.1 J2.2 J3.2)
MISO0: XT_NANO_DOCK (U1.8), Connectors (R17.1)
MISO0_prot: Connectors (J5.6 R17.2), Protection (D4.1)
MISO1: XT_NANO_DOCK (U1.17), Connectors (R21.1)
MISO1_prot: Connectors (J8.6 R21.2), Protection (D5.1)
MOSI0: XT_NANO_DOCK (U1.9), Connectors (R15.1)
MOSI0_prot: Connectors (J5.4 R15.2), Protection (D4.4)
MOSI1: XT_NANO_DOCK (U1.18), Connectors (R19.1)
MOSI1_prot: Connectors (J8.4 R19.2), Protection (D5.4)
NetIC1_1: PeltierControl (IC1.1), Connectors (J1.13)
NetIC2_1: PeltierControl (IC2.1), Connectors (J1.5)
NetJ1_2: Connectors (J1.2), USBConverter (R42.1)
NetJ1_10: Connectors (J1.10), USBConverter (R41.1)
NetJ6_1: PeltierControl (7 pins), Connectors (J6.1)
NetJ6_2: PeltierControl (7 pins), Connectors (J6.2)
PDC_3V3: XT_NANO_DOCK (R2.2 R3.2), Connectors (J1.12)
SCK0: XT_NANO_DOCK (U1.7), Connectors (R16.2)
SCK0_prot: Connectors (J5.5 R16.1), Protection (D4.3)
SCK1: XT_NANO_DOCK (U1.16), Connectors (R20.2)
SCK1_prot: Connectors (J8.5 R20.1), Protection (D5.3)
SCL0: XT_NANO_DOCK (U1.5), Connectors (J9.4 R8.1)
SCL1: XT_NANO_DOCK (U1.14), Connectors (J1.7 R7.1)
SDA0: XT_NANO_DOCK (U1.4), Connectors (J9.3 R9.1)
SDA1: XT_NANO_DOCK (U1.13), Connectors (J1.15 R6.1)
SS0: XT_NANO_DOCK (U1.6), Connectors (R10.2)
SS0_prot: Connectors (J5.3 R10.1), Protection (D4.5)
SS1: XT_NANO_DOCK (U1.15), Connectors (R18.2)
SS1_prot: Connectors (J8.3 R18.1), Protection (D5.5)
USB_prot_N: Connectors (J7.2), Protection (D3.3), USBConverter (R34.2)
USB_prot_P: Connectors (J7.3), Protection (D3.4), USBConverter (R33.2)